# Altium project P-MT3620EXMSTLP-1-0.PrjPcb (part 1 of 3)
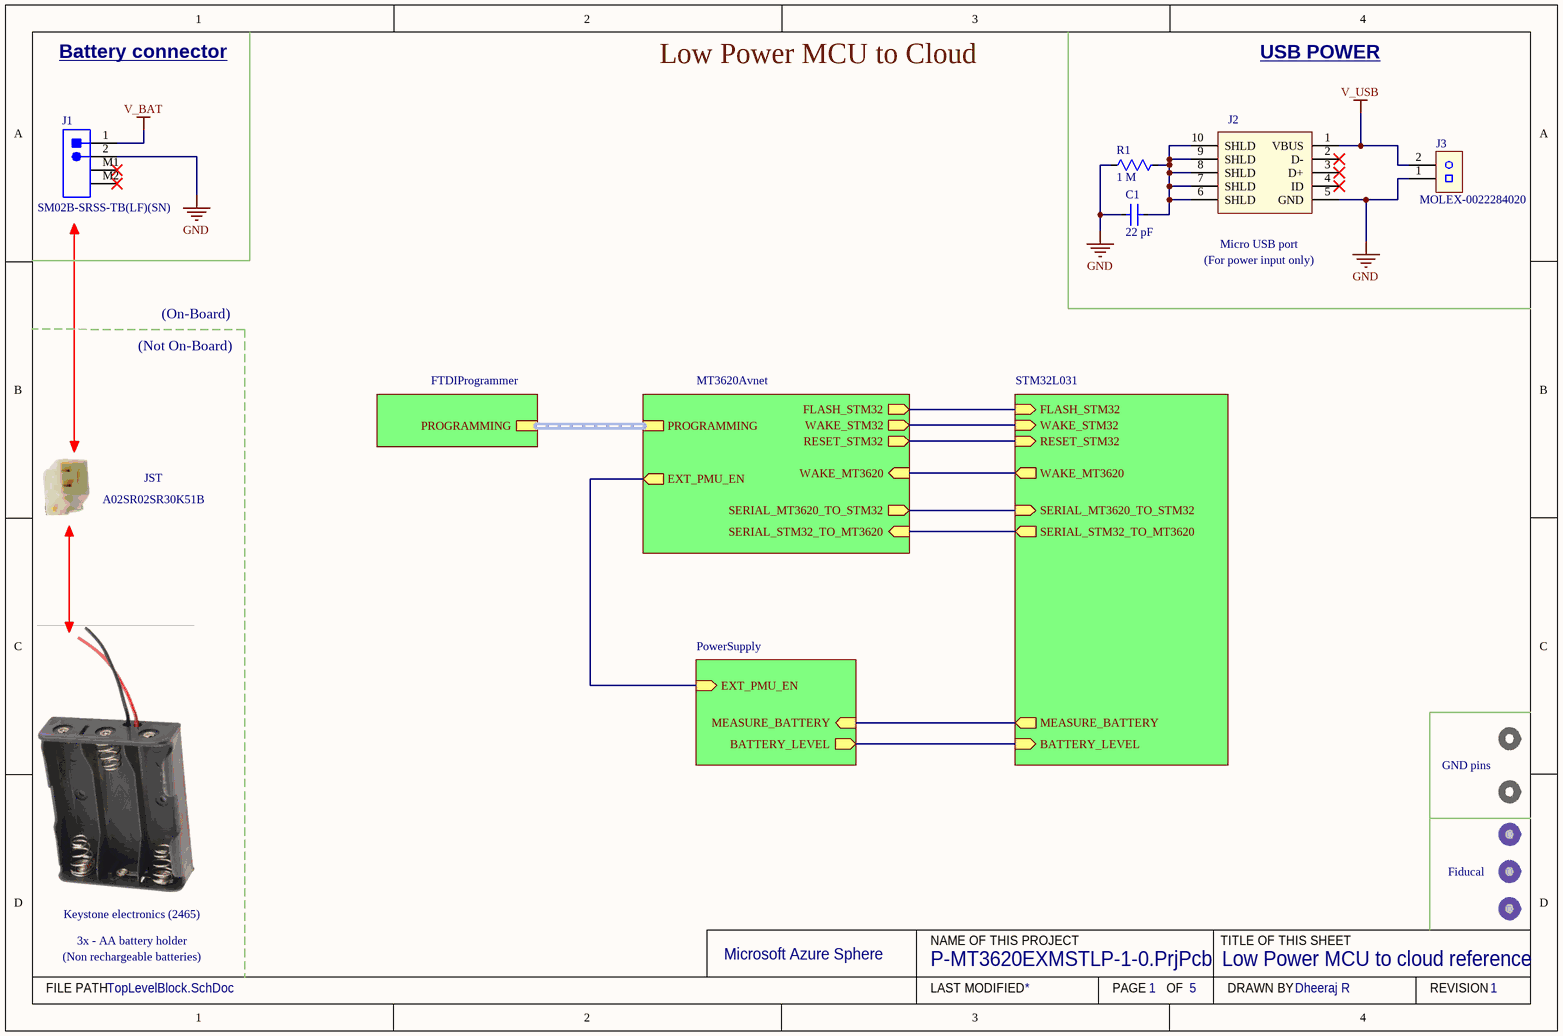
[diagram p0: TopLevelBlock.SchDoc]
DrawnBy: Dheeraj R; projectVersion: 1.0
5 sheets, 96 parts. Net scope: hierarchical (ports join the sheet entries above them; power ports are global).
Board file: P-MT3620EXMSTLP-1-0.PcbDoc
Sheets:
  TopLevelBlock.SchDoc
    FTDIProgrammer = FTDIProgrammer.SchDoc
    MT3620Avnet = MT3620AvnetModule.SchDoc
    PowerSupply = PowerSupply.SchDoc
    STM32L031 = STM32L031.SchDoc

## Sheet TopLevelBlock.SchDoc: Low Power MCU to cloud reference
size A4; DrawnBy: Dheeraj R; DocumentNumber: 1; Revision: 1; SheetNumber: 1; SheetTotal: 5

### Parts
C1  22 pF  [CC0603]
J1  SM02B-SRSS-TB(LF)(SN)  [SM02B-SRSS-TB]
J2  USB Micro-B  [MOLEX-1050170001]  (value not drawn)
J3  MOLEX-0022284020  [0022284020]
R1  1 M  [RC0603]

### Sub-sheets
FTDIProgrammer = FTDIProgrammer.SchDoc: PROGRAMMING (harness FTDIHeader)
MT3620Avnet = MT3620AvnetModule.SchDoc: SERIAL_MT3620_TO_STM32 (out), SERIAL_STM32_TO_MT3620 (in), FLASH_STM32 (out), RESET_STM32 (out), WAKE_MT3620 (in), WAKE_STM32 (out), PROGRAMMING (harness FTDIHeader), EXT_PMU_EN (out)
PowerSupply = PowerSupply.SchDoc: EXT_PMU_EN (in), MEASURE_BATTERY (in), BATTERY_LEVEL (out)
STM32L031 = STM32L031.SchDoc: SERIAL_STM32_TO_MT3620 (out), FLASH_STM32 (in), WAKE_MT3620 (out), WAKE_STM32 (in), RESET_STM32 (in), MEASURE_BATTERY (out), BATTERY_LEVEL (in), SERIAL_MT3620_TO_STM32 (in)

### Nets
GND: C1.1 J1.2 J2.5(GND) J3.1 R1.2
V_BAT: J1.1
V_USB: J2.1(VBUS) J3.2
BATTERY_LEVEL: sheet PowerSupply/BATTERY_LEVEL, sheet STM32L031/BATTERY_LEVEL
EXT_PMU_EN: sheet MT3620Avnet/EXT_PMU_EN, sheet PowerSupply/EXT_PMU_EN
FLASH_STM32: sheet MT3620Avnet/FLASH_STM32, sheet STM32L031/FLASH_STM32
MEASURE_BATTERY: sheet PowerSupply/MEASURE_BATTERY, sheet STM32L031/MEASURE_BATTERY
RESET_STM32: sheet MT3620Avnet/RESET_STM32, sheet STM32L031/RESET_STM32
STM32_RX: sheet MT3620Avnet/SERIAL_MT3620_TO_STM32, sheet STM32L031/SERIAL_MT3620_TO_STM32
STM32_TX: sheet MT3620Avnet/SERIAL_STM32_TO_MT3620, sheet STM32L031/SERIAL_STM32_TO_MT3620
WAKE_MT3620: sheet MT3620Avnet/WAKE_MT3620, sheet STM32L031/WAKE_MT3620
WAKE_STM32: sheet MT3620Avnet/WAKE_STM32, sheet STM32L031/WAKE_STM32
NetC1_2: C1.2 J2.6(SHLD) J2.7(SHLD) J2.8(SHLD) J2.9(SHLD) J2.10(SHLD) R1.1

Not connected (* = marked no-connect by the designer): J1 M1* M2*; J2 2(D-)* 3(D+)* 4(ID)*

### Buses and harness runs
harness sheet FTDIProgrammer/PROGRAMMING = sheet MT3620Avnet/PROGRAMMING

### Notes on the sheet
- Battery connector
- Low Power MCU to Cloud
- USB POWER
- (near J2) Micro USB port
- (On-Board)
- (For power input only)
- (Not On-Board)
- A02SR02SR30K51B
- JST
- GND pins
- Keystone electronics (2465)
- Fiducal
- 3x - AA battery holder
- (Non rechargeable batteries)
- Microsoft Azure Sphere
- NAME OF THIS PROJECT
- TITLE OF THIS SHEET
- FILE PATH
- LAST MODIFIED
- PAGE
- OF
- DRAWN BY
- REVISION

### Library data of the parts
C1 = CC0603JRNPO0BN220: 22PF 0603 100V C0G/NPO; Manufacturer: Yageo; Dielectric: C0G; Tolerance: 5%; Supplier 1: Digi-Key; Manufacturer Part Number: CC0603JRNPO0BN220; RoHS: Yes; Category: Ceramic Capacitors; Stock 1: 18072; Pricing 1: 1=0.10000, 10=0.06800, 50=0.03680, 100=0.03010, 500=0.02152, 1000=0.01691 (USD); Mount: Surface Mount; Case/Package: 0603; Weight: 7.1E-05oz; Case Code (Imperial): 0603; Case Code (Metric): 1608; Min Operating Temperature: -55°C; Max Operating Temperature: 125°C; Capacitance: 22pF; Termination: SMD/SMT; Composition: Ceramic; Packaging: Tape and Reel; Voltage Rating: 100V; Voltage Rating (DC): 100V; Length: 1.6mm; Height: 0.8mm; Thickness: 0.035inch; Depth: 0.8mm; Width: 0.8mm; Lead Free: Lead Free; ComponentLink1URL: https://datasheet.ciiva.com/13207/upy-gp-np0-16v-to-50v-8-13207786.pdf?src-supplier=Mouser; ComponentLink1Description: https://datasheet.ciiva.com/13207/upy-gp-np0-16v-to-50v-8-13207786.pdf?src-supplier=Mouser; Supplier Part Number 1: 311-1755-1-ND
J1 = SM02B-SRSS-TB(LF)(SN): Conn Shrouded Header HDR 2 POS 1mm Solder RA SMD T/R; Manufacturer: JST; Number of Contacts: 2; Voltage Rating: 50V; Current Rating: 700mA; Insulation Resistance: 100MR; Connector Type: Header,Male Pin; Contact Resistance: 40mR; Max Current Rating: 1A; Supplier 1: Farnell; Manufacturer Part Number: SM02B-SRSS-TB(LF)(SN); Stock 1: 47603; Pricing 1: 100=0.24600, 500=0.21400, 1000=0.17700, 2500=0.15600, 5000=0.13600, 10000=0.13000 (GBP); RoHS: Yes; Mount: Surface Mount; Contact Material: Copper Alloy,Copper; Housing Color: Beige; Material: Polyamide; Housing Material: Polyamide; Contact Shape: Square; Insulation Material: Nylon; Insulation Color: Natural; Color: Natural; Contact Plating: Tin,Copper,Lead; Min Operating Temperature: -25°C; Max Operating Temperature: 85°C; Orientation: Right Angle; Termination: Solder; Number of Rows: 1; Number of Positions: 2; Max Voltage Rating (AC): 50V; Fastening Type: Push,Pull; Packaging: Tape and Reel; Voltage Rating (AC): 50V; Length: 4mm; Pitch: 1mm; Depth: 4.95mm; Lead Pitch: 1mm; Flammability Rating: UL94 V-0; Lead Free: Lead Free; REACH SVHC: No SVHC; ComponentLink1URL: https://datasheet.ciiva.com/26924/getdatasheetpartid-640850-26924055.pdf?src-supplier=Verical; ComponentLink1Description: https://datasheet.ciiva.com/26924/getdatasheetpartid-640850-26924055.pdf?src-supplier=Verical; ComponentLink2URL: https://datasheet.ciiva.com/712/esr-712467.pdf?src-supplier=Digi-Key; ComponentLink2Description: https://datasheet.ciiva.com/712/esr-712467.pdf?src-supplier=Digi-Key; ComponentLink3URL: https://datasheet.ciiva.com/712/esr-712468.pdf?src-supplier=Digi-Key; ComponentLink3Description: https://datasheet.ciiva.com/712/esr-712468.pdf?src-supplier=Digi-Key; ComponentLink4URL: https://datasheet.ciiva.com/730/esr-730600.pdf?src-supplier=Digi-Key; ComponentLink4Description: https://datasheet.ciiva.com/730/esr-730600.pdf?src-supplier=Digi-Key; ComponentLink5URL: https://datasheet.ciiva.com/8052/91630-8052284.pdf?src-supplier=Element14; ComponentLink5Description: https://datasheet.ciiva.com/8052/91630-8052284.pdf?src-supplier=Element14; ComponentLink6URL: https://datasheet.ciiva.com/16391/sm02b-srss-tblfsn-16391308.pdf?src-supplier=Future+Electronics; ComponentLink6Description: https://datasheet.ciiva.com/16391/sm02b-srss-tblfsn-16391308.pdf?src-supplier=Future+Electronics; Supplier Part Number 1: 1679117
J2 = MOLEX-1050170001: Micro; B Type; receptacle; Bottom Mount, SMT, with Solder Tabs, Lead-Free; Manufacturer: Molex; Connector Type: USB,Receptacle; Number of Ports: 1; Number of Contacts: 5; Max Voltage Rating (AC): 30V; Current Rating: 1.8A; USB Standard: USB 2.0; Mating Cycles: 10000; Shielding: Shielded; Pitch: 0.65mm; Supplier 1: Digi-Key; Manufacturer Part Number: 1050170001; RoHS: Yes; Category: Connectors; Stock 1: 22049; Pricing 1: 1=0.91000, 10=0.80100, 25=0.75440, 50=0.72280, 100=0.69140, 250=0.62856, 500=0.56568, 1000=0.50283 (USD); Mount: Surface Mount,Through Hole; Contact Plating: Gold; Contact Material: Copper Alloy,Copper; Number of Terminals: 5; Housing Material: Polymer; Insulation Color: Black; Min Operating Temperature: -30°C; Max Operating Temperature: 85°C; Packaging: Tape and Reel; Gender: Receptacle; Package Quantity: 2000; Termination: Solder; Orientation: Right Angle; Features: Shielded; Voltage Rating (AC): 30V; Voltage Rating: 30V; Number of Positions: 5; Number of Circuits: 5; Length: 8.2mm; Depth: 7.5mm; Radiation Hardening: No; REACH SVHC: Unknown; Halogen Free: Low Halogen; Flammability Rating: UL94 V-0; ComponentLink1URL: https://datasheet.ciiva.com/3094/1050170001-io-connectors-3094416.pdf?src-supplier=Avnet; ComponentLink1Description: https://datasheet.ciiva.com/3094/1050170001-io-connectors-3094416.pdf?src-supplier=Avnet; ComponentLink2URL: https://datasheet.ciiva.com/4598/1050170001-io-connectors-152207-4598759.pdf?src-supplier=Mouser; ComponentLink2Description: https://datasheet.ciiva.com/4598/1050170001-io-connectors-152207-4598759.pdf?src-supplier=Mouser; ComponentLink3URL: https://datasheet.ciiva.com/8015/1631959-8015288.pdf?src-supplier=Element14; ComponentLink3Description: https://datasheet.ciiva.com/8015/1631959-8015288.pdf?src-supplier=Element14; ComponentLink4URL: https://datasheet.ciiva.com/851/1050170001-sd-851276.pdf?src-supplier=Digi-Key; ComponentLink4Description: https://datasheet.ciiva.com/851/1050170001-sd-851276.pdf?src-supplier=Digi-Key; ComponentLink5URL: https://datasheet.ciiva.com/5742/1598502-5742508.pdf?src-supplier=Farnell; ComponentLink5Description: https://datasheet.ciiva.com/5742/1598502-5742508.pdf?src-supplier=Farnell; ComponentLink6URL: https://datasheet.ciiva.com/22654/1688140-22654924.pdf?src-supplier=Element14; ComponentLink6Description: https://datasheet.ciiva.com/22654/1688140-22654924.pdf?src-supplier=Element14; ComponentLink7URL: https://datasheet.ciiva.com/30165/235271050170001-io-nectors-30165183.pdf?src-supplier=Onlinecomponents.com; ComponentLink7Description: https://datasheet.ciiva.com/30165/235271050170001-io-nectors-30165183.pdf?src-supplier=Onlinecomponents.com; ComponentLink8URL: https://datasheet.ciiva.com/16668/1050170001-io-connectors-16668598.pdf?src-supplier=Avnet+Europe; ComponentLink8Description: https://datasheet.ciiva.com/16668/1050170001-io-connectors-16668598.pdf?src-supplier=Avnet+Europe; ComponentLink9URL: https://datasheet.ciiva.com/851/1050170001-sd-851277.pdf?src-supplier=Digi-Key; ComponentLink9Description: https://datasheet.ciiva.com/851/1050170001-sd-851277.pdf?src-supplier=Digi-Key; ComponentLink10URL: https://datasheet.ciiva.com/851/1050170001-sd-851278.pdf?src-supplier=Digi-Key; ComponentLink10Description: https://datasheet.ciiva.com/851/1050170001-sd-851278.pdf?src-supplier=Digi-Key; Supplier Part Number 1: WM1399CT-ND
J3 = MOLEX-0022284020: CONN HEADER 2POS .100 VERT TIN; Manufacturer: Molex, LLC; Connector Type: Header, Unshrouded, Breakaway; Number of Positions: 2; Number of Positions Loaded: All; Pitch: 0.100" (2.54mm); Supplier 1: Digi-Key; Manufacturer Part Number: 0022284020; RoHS: RoHS Compliant; Category: Connectors, Interconnects; Stock 1: 10077; Pricing 1: 1=0.12, 10=0.108, 25=0.0808, 50=0.0692, 100=0.0668, 250=0.0576, 500=0.0553 (GBP); Packaging: Bulk; Contact Type: Male Pin; Number of Rows: 1; Row Spacing: -; Contact Mating Length: 0.240" (6.10mm); Mounting Type: Through Hole; Termination: Solder; Fastening Type: -; Features: -; Contact Finish: Tin; Contact Finish Thickness: 100µin (2.54µm); Color: Black; ComponentLink1URL: http://www.molex.com/pdm_docs/sd/022284020_sd.pdf; ComponentLink1Description: http://www.molex.com/pdm_docs/sd/022284020_sd.pdf; Supplier Part Number 1: WM50014-02-ND
R1 = RC0603FR-071ML: 1M 0603 Case 1% 0.1W 100ppm/C; Manufacturer: Yageo; Voltage Rating: 50V; Resistance: 1MR; Power Rating: 100mW; Temperature Coefficient: 100ppm/°C; Supplier 1: Digi-Key; Manufacturer Part Number: RC0603FR-071ML; RoHS: Yes; Category: Chip SMD Resistors; Stock 1: 2071757; Pricing 1: 1=0.10000, 10=0.02300, 100=0.00940, 1000=0.00421, 2500=0.00366 (USD); Case/Package: 0603; Number of Pins: 2; Case Code (Imperial): 0603; Case Code (Metric): 1608; Min Operating Temperature: -55°C; Max Operating Temperature: 155°C; Voltage Rating (DC): 50V; Tolerance: 1%; Packaging: Tape and Reel; Package Quantity: 5000; Termination: SMD/SMT; Composition: Thick Film; Military Standard: Not; Length: 1.6mm; Height: 0.45mm; Width: 0.8mm; Depth: 0.8mm; REACH SVHC: No SVHC; Lead Free: Lead Free; ComponentLink1URL: https://datasheet.ciiva.com/11819/0900766b80f96399-11819295.pdf?src-supplier=RSComponents; ComponentLink1Description: https://datasheet.ciiva.com/11819/0900766b80f96399-11819295.pdf?src-supplier=RSComponents; ComponentLink2URL: https://datasheet.ciiva.com/7983/443971-7983614.pdf?src-supplier=Element14; ComponentLink2Description: https://datasheet.ciiva.com/7983/443971-7983614.pdf?src-supplier=Element14; ComponentLink3URL: https://datasheet.ciiva.com/12555/rc0603-272842-12555388.pdf?src-supplier=Mouser; ComponentLink3Description: https://datasheet.ciiva.com/12555/rc0603-272842-12555388.pdf?src-supplier=Mouser; Supplier Part Number 1: 311-1.00MHRCT-ND

## Sheet FTDIProgrammer.SchDoc: FTDI Programming for MT3620
size A4; DrawnBy: Dheeraj R; DocumentNumber: 2; Revision: 1; SheetNumber: 2; SheetTotal: 5
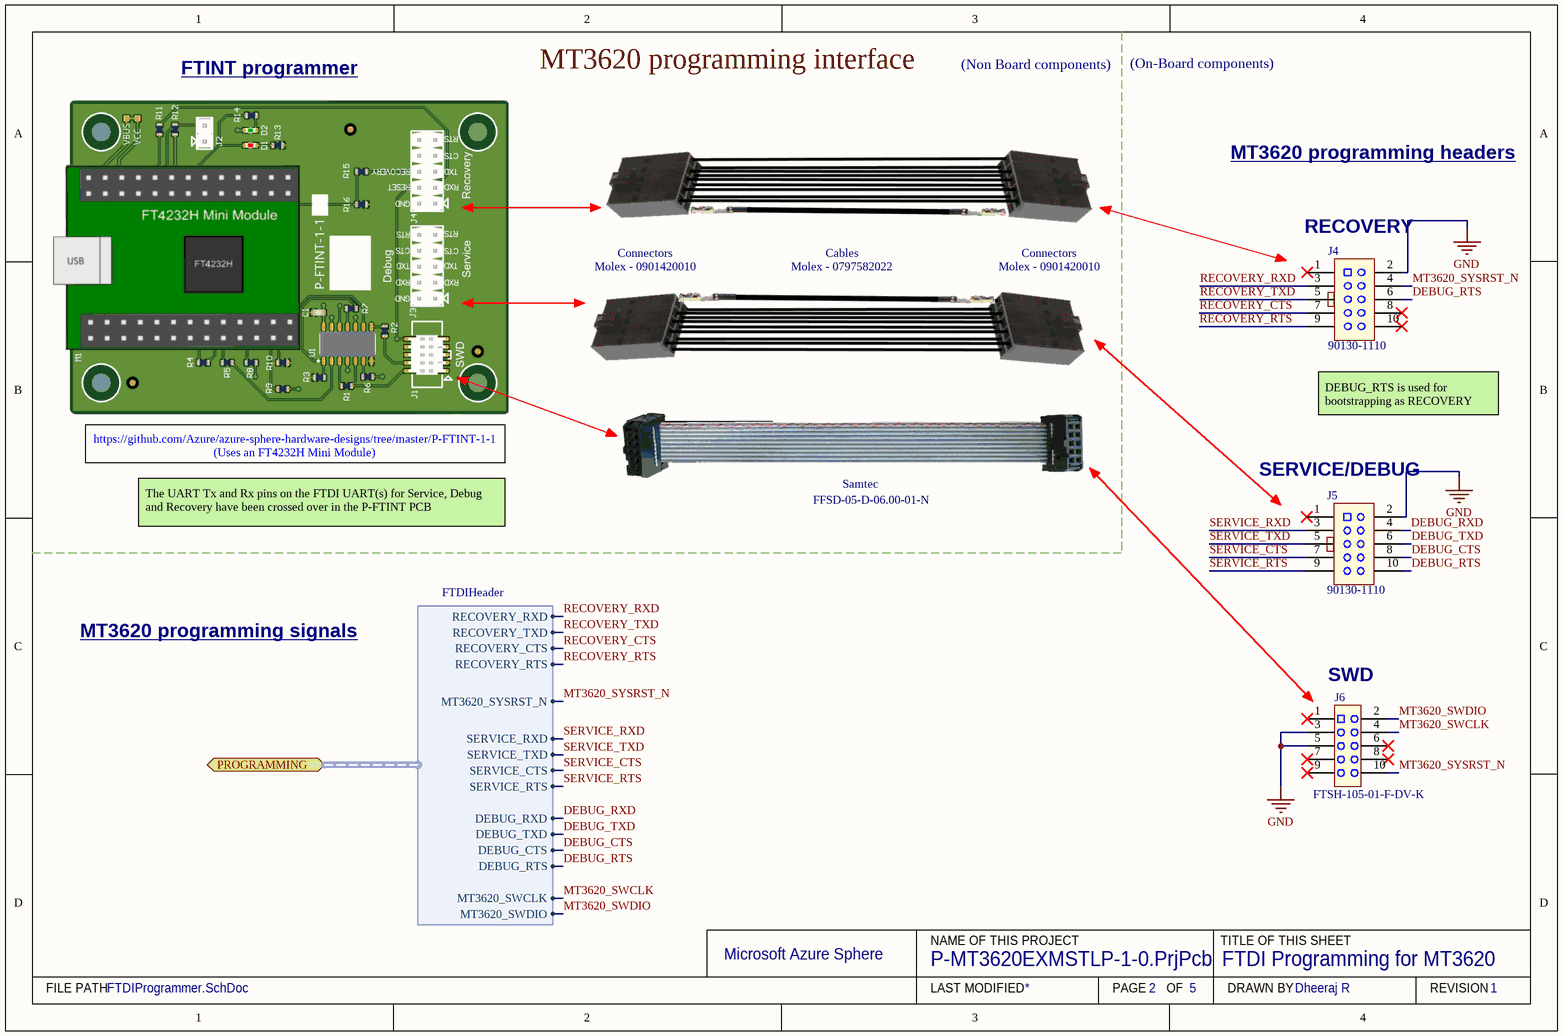
[diagram p1: FTDIProgrammer.SchDoc]

### Parts
J4  90130-1110  [0901301110]
J5  90130-1110  [0901301110]
J6  FTSH-105-01-F-DV-K  [SAMTEC-FTSH-105-01-X-DV-K]

### Ports
PROGRAMMING (bidir, harness FTDIHeader)

### Harnesses
FTDIHeader: RECOVERY_RXD, RECOVERY_TXD, RECOVERY_CTS, RECOVERY_RTS, MT3620_SYSRST_N, SERVICE_RXD, SERVICE_TXD, SERVICE_CTS, SERVICE_RTS, DEBUG_TXD, MT3620_SWCLK, MT3620_SWDIO, DEBUG_RXD, DEBUG_CTS, DEBUG_RTS

### Nets
GND: J4.2 J5.2 J6.3 J6.5
DEBUG_CTS: J5.8 ; port PROGRAMMING.DEBUG_CTS
DEBUG_RTS: J4.6 J5.10 ; port PROGRAMMING.DEBUG_RTS
DEBUG_RXD: J5.4 ; port PROGRAMMING.DEBUG_RXD
DEBUG_TXD: J5.6 ; port PROGRAMMING.DEBUG_TXD
MT3620_SWCLK: J6.4 ; port PROGRAMMING.MT3620_SWCLK
MT3620_SWDIO: J6.2 ; port PROGRAMMING.MT3620_SWDIO
MT3620_SYSRST_N: J4.4 J6.10 ; port PROGRAMMING.MT3620_SYSRST_N
RECOVERY_CTS: J4.7 ; port PROGRAMMING.RECOVERY_CTS
RECOVERY_RTS: J4.9 ; port PROGRAMMING.RECOVERY_RTS
RECOVERY_RXD: J4.3 ; port PROGRAMMING.RECOVERY_RXD
RECOVERY_TXD: J4.5 ; port PROGRAMMING.RECOVERY_TXD
SERVICE_CTS: J5.7 ; port PROGRAMMING.SERVICE_CTS
SERVICE_RTS: J5.9 ; port PROGRAMMING.SERVICE_RTS
SERVICE_RXD: J5.3 ; port PROGRAMMING.SERVICE_RXD
SERVICE_TXD: J5.5 ; port PROGRAMMING.SERVICE_TXD

Not connected (* = marked no-connect by the designer): J4 1* 8* 10*; J5 1*; J6 1* 6* 7* 8* 9*

### Notes on the sheet
- FTINT programmer
- MT3620 programming interface
- (Non Board components)
- (On-Board components)
- MT3620 programming headers
- (near J4) RECOVERY
- Connectors
  Molex - 0901420010
- Cables
  Molex - 0797582022
- (near J4) DEBUG_RTS is used for
  bootstrapping as RECOVERY
- https://github.com/Azure/azure-sphere-hardware-designs/tree/master/P-FTINT-1-1
  (Uses an FT4232H Mini Module)
- Samtec
- FFSD-05-D-06.00-01-N
- (near J5) SERVICE/DEBUG
- The UART Tx and Rx pins on the FTDI UART(s) for Service, Debug and Recovery have been crossed over in the P-FTINT PCB
- MT3620 programming signals
- (near J6) SWD
- Microsoft Azure Sphere
- NAME OF THIS PROJECT
- TITLE OF THIS SHEET
- FILE PATH
- LAST MODIFIED
- PAGE
- OF
- DRAWN BY
- REVISION

### Library data of the parts
J4 J5 = MOLEX-901301110: Conn Shrouded Header HDR 10 POS 2.54mm Solder ST Thru-Hole Tray; Manufacturer: Molex; Max Voltage Rating (DC): 350.35kV; Number of Positions: 10; Current Rating: 3A; Voltage Rating: 350V; Gender: Male; Glow Wire Compliant: Non-compliant; Supplier 1: Digi-Key; Manufacturer Part Number: 90130-1110; RoHS: Yes; Category: Headers and Wire Housings; Stock 1: 363; Pricing 1: 1=1.59000, 10=1.44600, 100=1.23900, 500=1.03250, 1000=0.88500, 5000=0.78470, 10000=0.76700 (USD); Mount: Through Hole; Contact Plating: Tin,Lead; Contact Material: Brass; Color: Black; Housing Color: Black; Housing Material: Polyester; Min Operating Temperature: -55°C; Max Operating Temperature: 125°C; Number of Rows: 2; Packaging: Tray; Termination: Through Hole; Number of Contacts: 10; Orientation: Vertical; Package Quantity: 1680; Voltage Rating (AC): 350V; Voltage Rating (DC): 350V; Number of Circuits: 10; Pitch: 2.54mm; Radiation Hardening: No; Lead Free: Lead Free; REACH SVHC: Unknown; ComponentLink1URL: https://datasheet.ciiva.com/11748/0900766b80d6024d-11748518.pdf?src-supplier=RSComponents; ComponentLink1Description: https://datasheet.ciiva.com/11748/0900766b80d6024d-11748518.pdf?src-supplier=RSComponents; ComponentLink2URL: https://datasheet.ciiva.com/5153/0901301110-pcb-headers-151692-5153946.pdf?src-supplier=Mouser; ComponentLink2Description: https://datasheet.ciiva.com/5153/0901301110-pcb-headers-151692-5153946.pdf?src-supplier=Mouser; ComponentLink3URL: https://datasheet.ciiva.com/30051/55070901301110-pcb-headers-30051500.pdf?src-supplier=Onlinecomponents.com; ComponentLink3Description: https://datasheet.ciiva.com/30051/55070901301110-pcb-headers-30051500.pdf?src-supplier=Onlinecomponents.com; Supplier Part Number 1: WM8235-ND
J6 = FTSH-105-01-F-DV-K: CONN HEADER 10POS DUAL .05" SMD; Manufacturer: Samtec Inc.; Connector Type: Header, Unshrouded; Number of Positions: 10; Number of Positions Loaded: All; Pitch: 0.050" (1.27mm); Supplier 1: Digi-Key; Manufacturer Part Number: FTSH-105-01-F-DV-K; RoHS: RoHS Compliant; Category: Connectors, Interconnects; Stock 1: 13304; Pricing 1: 1=2.26, 10=1.907, 50=1.647, 100=1.4737, 250=1.30032, 500=1.21362, 1000=1.12693, 2500=1.08358, 5000=1.06191 (GBP); Packaging: Tube; Contact Type: Male Pin; Number of Rows: 2; Row Spacing: 0.050" (1.27mm); Contact Mating Length: 0.120" (3.05mm); Mounting Type: Surface Mount; Termination: Solder; Fastening Type: -; Features: Keying Shroud; Contact Finish: Gold; Contact Finish Thickness: 3µin (0.08µm); Color: Black; ComponentLink1URL: http://suddendocs.samtec.com/prints/ftsh-1xx-xx-xxx-dv-xxx-mkt.pdf; ComponentLink1Description: http://suddendocs.samtec.com/prints/ftsh-1xx-xx-xxx-dv-xxx-mkt.pdf; Supplier Part Number 1: SAM8796-ND

## Sheet MT3620AvnetModule.SchDoc: Avnet module for MT3620
size A4; DrawnBy: Dheeraj R; DocumentNumber: 3; Revision: 1; SheetNumber: 3; SheetTotal: 5
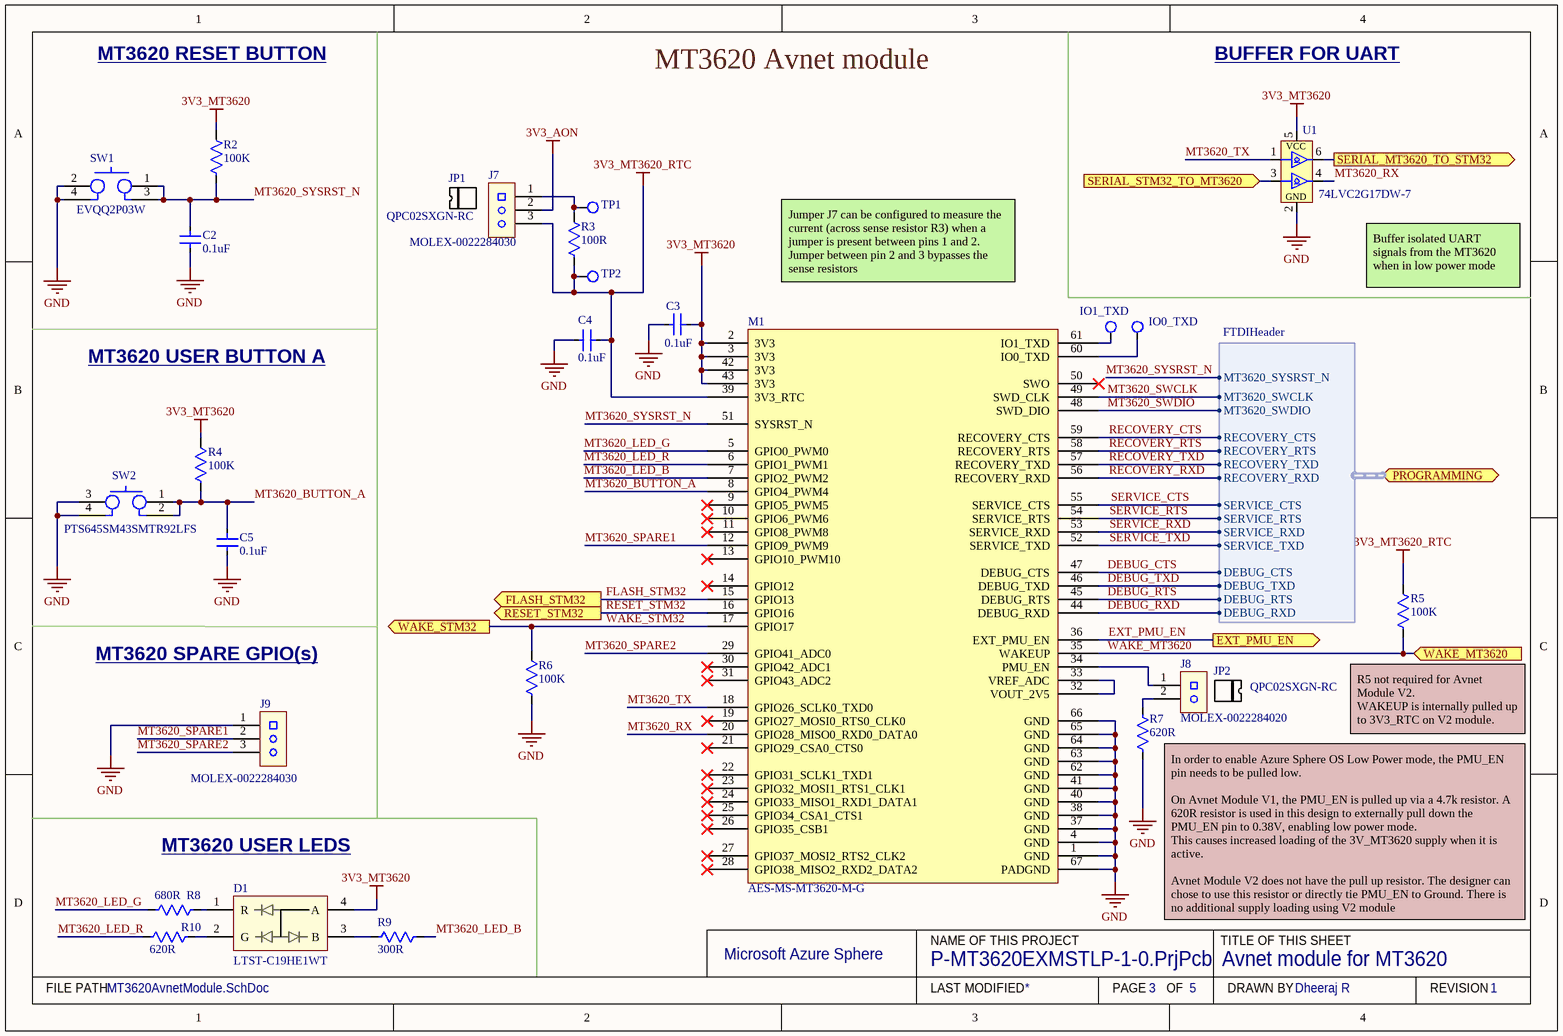
[diagram p2: MT3620AvnetModule.SchDoc]

### Parts
C2  0.1uF  [CC0603]
C3  0.1uF  [CC0603]
C4  0.1uF  [CC0603]
C5  0.1uF  [CC0603]
D1  LTST-C19HE1WT  [LTST-C19HE1WT]
IO0_TXD  TestPoint  [Pad1.27mm]  (value not drawn)  (no BOM)
IO1_TXD  TestPoint  [Pad1.27mm]  (value not drawn)  (no BOM)
J7  MOLEX-0022284030  [0022284030]
J8  MOLEX-0022284020  [0022284020]
J9  MOLEX-0022284030  [0022284030]
JP1  QPC02SXGN-RC  (mechanical)
JP2  QPC02SXGN-RC  (mechanical)
M1  AES-MS-MT3620-M-G  [AES-MS-MT3620-M-G]
R2  100K  [VISHAY-0603]
R3  100R  [VISHAY-0603]
R4  100K  [VISHAY-0603]
R5  100K  [VISHAY-0603]
R6  100K  [VISHAY-0603]
R7  620R  [RC0603]
R8  680R  [RC0603]
R9  300R  [RC0603]
R10  620R  [RC0603]
SW1  SWI TACT SPN0 PANASONIC EVQQ2P03W  [EVQQ2P03W]  (value not drawn)
SW2  PTS645SM43SMTR92LFS  [C&K PTS645SM43SMTR92LFS]
TP1  TestPointHole  [PTH1.27mm-0.9mm]  (value not drawn)  (no BOM)
TP2  TestPointHole  [PTH1.27mm-0.9mm]  (value not drawn)  (no BOM)
U1  74LVC2G17DW-7  [Nexperia-SOT363]

### Ports
EXT_PMU_EN (out), FLASH_STM32 (out), PROGRAMMING (bidir, harness FTDIHeader), RESET_STM32 (out), SERIAL_MT3620_TO_STM32 (out), SERIAL_STM32_TO_MT3620 (in), WAKE_MT3620 (in), WAKE_STM32 (out)

### Harnesses
FTDIHeader: RECOVERY_RXD, RECOVERY_TXD, RECOVERY_CTS, RECOVERY_RTS, MT3620_SYSRST_N, SERVICE_RXD, SERVICE_TXD, SERVICE_CTS, SERVICE_RTS, DEBUG_TXD, MT3620_SWCLK, MT3620_SWDIO, DEBUG_CTS, DEBUG_RTS, DEBUG_RXD

### Nets
3V3_AON: J7.2
3V3_MT3620: C3.2 D1.4(A) M1.2(3V3) M1.3(3V3) M1.42(3V3) M1.43(3V3) R2.2 R4.2 U1.5
3V3_MT3620_RTC: C4.2 J7.3 M1.39(3V3_RTC) R3.2 R5.2 TP2.1
GND: C2.1 C3.1 C4.1 C5.1 J9.1 M1.1(GND) M1.4(GND) M1.37(GND) M1.38(GND) M1.40(GND) M1.41(GND) M1.62(GND) M1.63(GND) M1.64(GND) M1.65(GND) M1.66(GND) M1.67(PADGND) R6.1 R7.1 SW1.2 SW1.4 SW2.3 SW2.4 U1.2
DEBUG_CTS: M1.47(DEBUG_CTS) ; port PROGRAMMING.DEBUG_CTS
DEBUG_RTS: M1.45(DEBUG_RTS) ; port PROGRAMMING.DEBUG_RTS
DEBUG_RXD: M1.44(DEBUG_RXD) ; port PROGRAMMING.DEBUG_RXD
DEBUG_TXD: M1.46(DEBUG_TXD) ; port PROGRAMMING.DEBUG_TXD
EXT_PMU_EN: M1.36(EXT_PMU_EN) ; port EXT_PMU_EN
FLASH_STM32: M1.15(GPIO13) ; port FLASH_STM32
MT3620_BUTTON_A: C5.2 M1.8(GPIO4_PWM4) R4.1 SW2.1 SW2.2
MT3620_LED_B: M1.7(GPIO2_PWM2) R9.2
MT3620_LED_G: M1.5(GPIO0_PWM0) R8.1
MT3620_LED_R: M1.6(GPIO1_PWM1) R10.1
MT3620_RX: M1.20(GPIO28_MISO0_RXD0_DATA0) U1.4
MT3620_SPARE1: J9.2 M1.12(GPIO9_PWM9)
MT3620_SPARE2: J9.3 M1.29(GPIO41_ADC0)
MT3620_SWCLK: M1.49(SWD_CLK) ; port PROGRAMMING.MT3620_SWCLK
MT3620_SWDIO: M1.48(SWD_DIO) ; port PROGRAMMING.MT3620_SWDIO
MT3620_SYSRST_N: C2.2 M1.51(SYSRST_N) R2.1 SW1.1 SW1.3 ; port PROGRAMMING.MT3620_SYSRST_N
MT3620_TX: M1.18(GPIO26_SCLK0_TXD0) U1.1
RECOVERY_CTS: M1.59(RECOVERY_CTS) ; port PROGRAMMING.RECOVERY_CTS
RECOVERY_RTS: M1.58(RECOVERY_RTS) ; port PROGRAMMING.RECOVERY_RTS
RECOVERY_RXD: M1.56(RECOVERY_RXD) ; port PROGRAMMING.RECOVERY_RXD
RECOVERY_TXD: M1.57(RECOVERY_TXD) ; port PROGRAMMING.RECOVERY_TXD
RESET_STM32: M1.16(GPIO16) ; port RESET_STM32
SERVICE_CTS: M1.55(SERVICE_CTS) ; port PROGRAMMING.SERVICE_CTS
SERVICE_RTS: M1.54(SERVICE_RTS) ; port PROGRAMMING.SERVICE_RTS
SERVICE_RXD: M1.53(SERVICE_RXD) ; port PROGRAMMING.SERVICE_RXD
SERVICE_TXD: M1.52(SERVICE_TXD) ; port PROGRAMMING.SERVICE_TXD
STM32_RX: U1.6 ; port SERIAL_MT3620_TO_STM32
STM32_TX: U1.3 ; port SERIAL_STM32_TO_MT3620
WAKE_MT3620: M1.35(WAKEUP) R5.1 ; port WAKE_MT3620
WAKE_STM32: M1.17(GPIO17) R6.2 ; port WAKE_STM32
NetD1_1: D1.1(R) R8.2
NetD1_2: D1.2(G) R10.2
NetD1_3: D1.3(B) R9.1
NetIO0_TXD_1: IO0_TXD.1 M1.60(IO0_TXD)
NetIO1_TXD_1: IO1_TXD.1 M1.61(IO1_TXD)
NetJ7_1: J7.1 R3.1 TP1.1
NetJ8_1: J8.1 M1.34(PMU_EN)
NetJ8_2: J8.2 R7.2
NetM1_32: M1.32(VOUT_2V5) M1.33(VREF_ADC)

Not connected (* = marked no-connect by the designer): M1 9(GPIO5_PWM5)* 10(GPIO6_PWM6)* 11(GPIO8_PWM8)* 13(GPIO10_PWM10)* 14(GPIO12)* 19(GPIO27_MOSI0_RTS0_CLK0)* 21(GPIO29_CSA0_CTS0)* 22(GPIO31_SCLK1_TXD1)* 23(GPIO32_MOSI1_RTS1_CLK1)* 24(GPIO33_MISO1_RXD1_DATA1)* 25(GPIO34_CSA1_CTS1)* 26(GPIO35_CSB1)* 27(GPIO37_MOSI2_RTS2_CLK2)* 28(GPIO38_MISO2_RXD2_DATA2)* 30(GPIO42_ADC1)* 31(GPIO43_ADC2)* 50(SWO)*

### Notes on the sheet
- MT3620 RESET BUTTON
- MT3620 Avnet module
- BUFFER FOR UART
- Jumper J7 can be configured to measure the current (across sense resistor R3) when a jumper is present between pins 1 and 2.
  Jumper between pin 2 and 3 bypasses the sense resistors
- Buffer isolated UART signals from the MT3620 when in low power mode
- MT3620 USER BUTTON A
- MT3620 SPARE GPIO(s)
- (near R5) R5 not required for Avnet Module V2.
  WAKEUP is internally pulled up to 3V3_RTC on V2 module.
- MT3620 USER LEDS
- (near R7) In order to enable Azure Sphere OS Low Power mode, the PMU_EN pin needs to be pulled low.
  On Avnet Module V1, the PMU_EN is pulled up via a 4.7k resistor. A 620R resistor is used in this design to externally pull down the PMU_EN pin to 0.38V, enabling low power mode.
  This causes increased loading of the 3V_MT3620 supply when it is active.
  Avnet Module V2 does not have the pull up resistor. The designer can chose to use this resistor or directly tie PMU_EN to Ground. There is no additional supply loading using V2 module
- Microsoft Azure Sphere
- NAME OF THIS PROJECT
- TITLE OF THIS SHEET
- FILE PATH
- LAST MODIFIED
- PAGE
- OF
- DRAWN BY
- REVISION
- (in symbol 74LVC2G17DW-7) VCC; GND

### Library data of the parts
C2-C5 = CC0603KRX7R8BB104: 0.1uF, 0603, CC0603KRX7R8BB104, Yageo, 25V, X7R, 10%, FULL REEL; Capacitance: 100nF; Supplier 1: Digi-Key; Manufacturer: Yageo; Manufacturer Part Number: CC0603KRX7R8BB104; RoHS: Yes; Category: Ceramic Capacitors; Stock 1: 12615855; Pricing 1: 1=0.10000, 10=0.05300, 100=0.02340, 500=0.01674, 1000=0.01316 (USD); Mount: Surface Mount; Case/Package: 0603; Number of Pins: 2; Case Code (Imperial): 0603; Case Code (Metric): 1608; Min Operating Temperature: -55°C; Max Operating Temperature: 125°C; Tolerance: 10%; Dielectric: X7R; Voltage Rating: 25V; Packaging: Tape and Reel; Package Quantity: 1; Voltage Rating (DC): 25V; Termination: SMD/SMT; Composition: Ceramic; Voltage: 25V; Length: 1.6mm; Height: 0.8mm; Width: 0.8mm; Thickness: 0.035inch; Depth: 0.8mm; Radiation Hardening: No; REACH SVHC: Unknown; Lead Free: Lead Free; Halogen Free: Halogen Free; ComponentLink1URL: https://datasheet.ciiva.com/11786/0900766b80c10176-11786120.pdf?src-supplier=RSComponents; ComponentLink1Description: https://datasheet.ciiva.com/11786/0900766b80c10176-11786120.pdf?src-supplier=RSComponents; ComponentLink2URL: https://datasheet.ciiva.com/144/mlccorderingcode-144075.pdf?src-supplier=Digi-Key; ComponentLink2Description: https://datasheet.ciiva.com/144/mlccorderingcode-144075.pdf?src-supplier=Digi-Key; ComponentLink3URL: https://datasheet.ciiva.com/17434/upy-gphc-x7r-6-3v-to-50v-8-17434263.pdf?src-supplier=Avnet+Europe; ComponentLink3Description: https://datasheet.ciiva.com/17434/upy-gphc-x7r-6-3v-to-50v-8-17434263.pdf?src-supplier=Avnet+Europe; ComponentLink4URL: https://datasheet.ciiva.com/26829/getdatasheetpartid-403577-26829431.pdf?src-supplier=Verical; ComponentLink4Description: https://datasheet.ciiva.com/26829/getdatasheetpartid-403577-26829431.pdf?src-supplier=Verical; ComponentLink5URL: https://datasheet.ciiva.com/11587/upy-gphc-x7r-6-3v-to-50v-8-11587208.pdf?src-supplier=Avnet; ComponentLink5Description: https://datasheet.ciiva.com/11587/upy-gphc-x7r-6-3v-to-50v-8-11587208.pdf?src-supplier=Avnet; ComponentLink6URL: https://datasheet.ciiva.com/13389/upy-gphc-x7r-6-3v-to-50v-8-13389352.pdf?src-supplier=Mouser; ComponentLink6Description: https://datasheet.ciiva.com/13389/upy-gphc-x7r-6-3v-to-50v-8-13389352.pdf?src-supplier=Mouser; ComponentLink7URL: https://datasheet.ciiva.com/28450/1489800-28450584.pdf?src-supplier=Element14; ComponentLink7Description: https://datasheet.ciiva.com/28450/1489800-28450584.pdf?src-supplier=Element14; ComponentLink8URL: https://datasheet.ciiva.com/144/mlccorderingcode-144073.pdf?src-supplier=Digi-Key; ComponentLink8Description: https://datasheet.ciiva.com/144/mlccorderingcode-144073.pdf?src-supplier=Digi-Key; ComponentLink9URL: https://datasheet.ciiva.com/144/mlccorderingcode-144074.pdf?src-supplier=Digi-Key; ComponentLink9Description: https://datasheet.ciiva.com/144/mlccorderingcode-144074.pdf?src-supplier=Digi-Key; ComponentLink10URL: https://datasheet.ciiva.com/7978/1489800-7978155.pdf?src-supplier=Element14; ComponentLink10Description: https://datasheet.ciiva.com/7978/1489800-7978155.pdf?src-supplier=Element14; Supplier Part Number 1: 311-1341-1-ND
D1 = LTST-C19HE1WT: LED RGB DIFFUSED 0606 SMD; Manufacturer: Lite-On Inc.; Color: Red, Green, Blue (RGB); Lens Color: White; Millicandela Rating: 112.5mcd Red, 281mcd Green, 104mcd Blue; Lens Style/Size: Rectangle with Flat Top, 1.15mm x 1.60mm; Voltage - Forward (Vf) (Typ): 2.1V Red, 3.35V Green, 3.35V Blue; Current - Test: 20mA Red, 20mA Green, 20mA Blue; Viewing Angle: 130°; Wavelength - Dominant: 624nm Red, 525nm Green, 470nm Blue; Wavelength - Peak: 632nm Red, 520nm Green, 468nm Blue; Supplier 1: Digi-Key; Manufacturer Part Number: LTST-C19HE1WT; RoHS: RoHS Compliant; Category: Optoelectronics; Stock 1: 464778; Pricing 1: 1=0.45, 10=0.32, 25=0.2616, 100=0.2093, 250=0.17664, 500=0.15048, 1000=0.11776 (GBP); Packaging: Cut Tape (CT); Part Status: Active; Lens Transparency: Diffused; Mounting Type: Surface Mount; Features: -; Package / Case: 0606 (1616 Metric); Supplier Device Package: *; Size / Dimension: 1.60mm L x 1.60mm W; Height (Max): 0.35mm; ComponentLink1URL: http://optoelectronics.liteon.com/upload/download/DS22-2008-0044/S_110_LTST-C19HE1WT.pdf; ComponentLink1Description: http://optoelectronics.liteon.com/upload/download/DS22-2008-0044/S_110_LTST-C19HE1WT.pdf; Supplier Part Number 1: 160-2162-1-ND
IO0_TXD IO1_TXD = TestPoint: Test Point
J7 J9 = MOLEX-0022284030: CONN HEADER 3POS .100 VERT TIN; Manufacturer: Molex, LLC; Connector Type: Header, Unshrouded, Breakaway; Number of Positions: 3; Number of Positions Loaded: All; Pitch: 0.100" (2.54mm); Supplier 1: Digi-Key; Manufacturer Part Number: 0022284030; RoHS: RoHS Compliant; Category: Connectors, Interconnects; Stock 1: 4665; Pricing 1: 1=0.12, 10=0.115, 25=0.0984, 50=0.086, 100=0.0799, 250=0.07068, 500=0.0676 (GBP); Packaging: Bulk; Contact Type: Male Pin; Number of Rows: 1; Row Spacing: -; Contact Mating Length: 0.240" (6.10mm); Mounting Type: Through Hole; Termination: Solder; Fastening Type: -; Features: -; Contact Finish: Tin; Contact Finish Thickness: 100µin (2.54µm); Color: Black; ComponentLink1URL: http://www.molex.com/pdm_docs/sd/022284030_sd.pdf; ComponentLink1Description: http://www.molex.com/pdm_docs/sd/022284030_sd.pdf; Supplier Part Number 1: WM50014-03-ND
J8 = MOLEX-0022284020: as J3 on sheet TopLevelBlock; Supplier 1: Digi-Key; Manufacturer Part Number: 0022284020; RoHS: RoHS Compliant; Category: Connectors, Interconnects; Stock 1: 10077; Pricing 1: 1=0.12, 10=0.108, 25=0.0808, 50=0.0692, 100=0.0668, 250=0.0576, 500=0.0553 (GBP); Packaging: Bulk; Contact Type: Male Pin; Number of Rows: 1; Row Spacing: -; Contact Mating Length: 0.240" (6.10mm); Mounting Type: Through Hole; Termination: Solder; Fastening Type: -; Features: -; Contact Finish: Tin; Contact Finish Thickness: 100µin (2.54µm); Color: Black; ComponentLink1URL: http://www.molex.com/pdm_docs/sd/022284020_sd.pdf; ComponentLink1Description: http://www.molex.com/pdm_docs/sd/022284020_sd.pdf; Supplier Part Number 1: WM50014-02-ND
JP1 JP2 = QPC02SXGN-RC: CONN JUMPER SHORTING .100" GOLD; Manufacturer: Sullins; Number of Positions: 2; Pitch: 0.1inch; Supplier 1: Digi-Key; Manufacturer Part Number: QPC02SXGN-RC; RoHS: Yes; Category: Connectors; Stock 1: 717508; Pricing 1: 1=0.10000, 10=0.05900, 25=0.04400, 50=0.03780, 100=0.03650, 250=0.03152, 500=0.03024, 1000=0.02646, 2500=0.02394 (USD); Case/Package: 100; Contact Plating: Gold; Package Quantity: 2000; Packaging: Bulk; Height: 0.235inch; Lead Free: Lead Free; ComponentLink1URL: https://datasheet.ciiva.com/767/284-sxgn-11510-767869.pdf?src-supplier=Digi-Key; ComponentLink1Description: https://datasheet.ciiva.com/767/284-sxgn-11510-767869.pdf?src-supplier=Digi-Key; Supplier Part Number 1: S9337-ND
M1 = AES-MS-MT3620-M-G (SAT)
R2 R4-R6 = RC0603FR-07100KL: 100K Ohm 0603 1% 0.1W(1/10W) 100ppm Paper T/R; Manufacturer: Yageo; Resistance: 100kR; Temperature Coefficient: 100ppm/°C; Voltage Rating (DC): 50V; Power Rating: 100mW; Working Voltage: 75V; Supplier 1: Digi-Key; Manufacturer Part Number: RC0603FR-07100KL; RoHS: Yes; Category: Chip SMD Resistors; Stock 1: 18400350; Pricing 1: 1=0.10000, 10=0.02300, 100=0.00940, 1000=0.00421, 2500=0.00366 (USD); Case/Package: 0603; Number of Pins: 2; Case Code (Imperial): 0603; Case Code (Metric): 1608; Min Operating Temperature: -55°C; Max Operating Temperature: 155°C; Tolerance: 1%; Composition: Thick Film; Packaging: Tape and Reel; Voltage Rating: 50V; Termination: SMD/SMT; Military Standard: Not; Number of Terminations: 2; Length: 1.6mm; Height: 0.45mm; Width: 0.8mm; Depth: 0.8mm; REACH SVHC: No SVHC; Lead Free: Lead Free; ComponentLink1URL: https://datasheet.ciiva.com/11808/0900766b80f96399-11808107.pdf?src-supplier=RSComponents; ComponentLink1Description: https://datasheet.ciiva.com/11808/0900766b80f96399-11808107.pdf?src-supplier=RSComponents; ComponentLink2URL: https://datasheet.ciiva.com/7983/443971-7983593.pdf?src-supplier=Element14; ComponentLink2Description: https://datasheet.ciiva.com/7983/443971-7983593.pdf?src-supplier=Element14; ComponentLink3URL: https://datasheet.ciiva.com/46440/1868787-46440889.pdf?src-supplier=Element14; ComponentLink3Description: https://datasheet.ciiva.com/46440/1868787-46440889.pdf?src-supplier=Element14; ComponentLink4URL: https://datasheet.ciiva.com/7746/1738695-7746234.pdf?src-supplier=Element14; ComponentLink4Description: https://datasheet.ciiva.com/7746/1738695-7746234.pdf?src-supplier=Element14; ComponentLink5URL: https://datasheet.ciiva.com/7746/1738695-7746235.pdf?src-supplier=Element14; ComponentLink5Description: https://datasheet.ciiva.com/7746/1738695-7746235.pdf?src-supplier=Element14; ComponentLink6URL: https://datasheet.ciiva.com/22747/443971-22747516.pdf?src-supplier=Element14; ComponentLink6Description: https://datasheet.ciiva.com/22747/443971-22747516.pdf?src-supplier=Element14; Supplier Part Number 1: 311-100KHRCT-ND
R3 = PCAN0603E1000BST5: 100 OHM Current Sense 0.1% 1/2W 0603; Manufacturer: Vishay Dale Thin Film; Max Power Dissipation: 500mW; Temperature Coefficient: 25ppm/°C; Supplier 1: Digi-Key; Manufacturer Part Number: PCAN0603E1000BST5; RoHS: Yes; Category: Chip SMD Resistors; Stock 1: 20633; Pricing 1: 1=1.31000, 10=1.15900, 100=0.84150 (USD); Case/Package: 0603; Case Code (Imperial): 0603; Case Code (Metric): 1608; Min Operating Temperature: -55°C; Max Operating Temperature: 155°C; Features: Moisture Resistant; Packaging: Tape and Reel; Resistance: 100R; Composition: Thin Film; Tolerance: 0.1%; Number of Terminations: 2; Length: 0.064inch; Height: 0.018inch; Width: 0.032inch; ComponentLink1URL: http://www.vishay.com/docs/60125/pcan.pdf?src-supplier=Digi-Key; ComponentLink1Description: http://www.vishay.com/docs/60125/pcan.pdf?src-supplier=Digi-Key; ComponentLink2URL: http://www.vishay.com/docs/49563/_pcan_vmn-pt0416.pdf?src-supplier=Digi-Key; ComponentLink2Description: http://www.vishay.com/docs/49563/_pcan_vmn-pt0416.pdf?src-supplier=Digi-Key; Supplier Part Number 1: 764-1252-1-ND
R7 R10 = RC0603FR-07620RL: 620 Ohm, 0603, 1% 0.1W(1/10W) 100ppm/ C Molded SMD Paper T/R; Manufacturer: Yageo; Power Rating: 100mW; Voltage Rating: 75V; Temperature Coefficient: 100ppm/°C; Voltage Rating (DC): 50V; Supplier 1: Digi-Key; Manufacturer Part Number: RC0603FR-07620RL; RoHS: Yes; Category: Chip SMD Resistors; Stock 1: 488; Pricing 1: 1=0.10000, 10=0.02300, 100=0.00940, 1000=0.00421, 2500=0.00366 (USD); Case/Package: 0603; Weight: 7.1E-05oz; Case Code (Imperial): 0603; Case Code (Metric): 1608; Min Operating Temperature: -55°C; Max Operating Temperature: 155°C; Resistance: 620R; Tolerance: 1%; Packaging: Tape and Reel; Termination: SMD/SMT; Composition: Thick Film; Military Standard: Not; Length: 1.6mm; Height: 0.45mm; Width: 0.8mm; Depth: 0.8mm; Lead Free: Lead Free; ComponentLink1URL: http://components.arrow.com/part/dataview/0323_00047453?src-supplier=Arrow+Europe; ComponentLink1Description: http://components.arrow.com/part/dataview/0323_00047453?src-supplier=Arrow+Europe; ComponentLink2URL: http://www.mouser.com/ds/2/447/RC0603-272842.pdf?src-supplier=Mouser; ComponentLink2Description: http://www.mouser.com/ds/2/447/RC0603-272842.pdf?src-supplier=Mouser; ComponentLink3URL: http://www.yageo.com/documents/recent/PYu-RC_Group_51_RoHS_L_10.pdf?src-supplier=Digi-Key; ComponentLink3Description: http://www.yageo.com/documents/recent/PYu-RC_Group_51_RoHS_L_10.pdf?src-supplier=Digi-Key; ComponentLink4URL: http://www.yageo.com/documents/recent/PYu-RC0603_51_RoHS_L_7.pdf?src-supplier=Future+Electronics; ComponentLink4Description: http://www.yageo.com/documents/recent/PYu-RC0603_51_RoHS_L_7.pdf?src-supplier=Future+Electronics; ComponentLink5URL: http://www.yageo.com/documents/recent/PYu-RC_Group_51_RoHS_L_9.pdf?src-supplier=Digi-Key; ComponentLink5Description: http://www.yageo.com/documents/recent/PYu-RC_Group_51_RoHS_L_9.pdf?src-supplier=Digi-Key; Supplier Part Number 1: 311-620HRCT-ND
R8 = RC0603FR-07680RL: 680R, 0603 YAGEO - RC0603FR-07680RL - SMD Chip Resistor, RC Series, 50 V, Thick Film, 100 mW; Tolerance: 1%; Temperature Coefficient: 100ppm/°C; Voltage Rating (DC): 50V; Power Rating: 100mW; Supplier 1: Digi-Key; Manufacturer: Yageo; Manufacturer Part Number: RC0603FR-07680RL; RoHS: Yes; Category: Chip SMD Resistors; Stock 1: 2382438; Pricing 1: 1=0.10000, 10=0.02300, 100=0.00940, 1000=0.00421, 2500=0.00366 (USD); Case/Package: 0603; Number of Pins: 2; Case Code (Imperial): 0603; Case Code (Metric): 1608; Min Operating Temperature: -55°C; Max Operating Temperature: 155°C; Resistance: 680R; Composition: Thick Film; Packaging: Tape and Reel; Number of Terminations: 2; Military Standard: Not; Voltage Rating: 50V; Package Quantity: 1; Max Power Dissipation: 100mW; Features: Moisture Resistant; Termination: SMD/SMT; Length: 1.6mm; Height: 0.022inch; Width: 0.031inch; Depth: 0.8mm; REACH SVHC: No SVHC; Lead Free: Lead Free; ComponentLink1URL: https://datasheet.ciiva.com/2553/pyu-r-int-thick-7-2553546.pdf?src-supplier=Digi-Key; ComponentLink1Description: https://datasheet.ciiva.com/2553/pyu-r-int-thick-7-2553546.pdf?src-supplier=Digi-Key; ComponentLink2URL: https://datasheet.ciiva.com/7746/443971-7746389.pdf?src-supplier=Element14; ComponentLink2Description: https://datasheet.ciiva.com/7746/443971-7746389.pdf?src-supplier=Element14; ComponentLink3URL: https://datasheet.ciiva.com/46412/443971-46412854.pdf?src-supplier=Element14; ComponentLink3Description: https://datasheet.ciiva.com/46412/443971-46412854.pdf?src-supplier=Element14; ComponentLink4URL: https://datasheet.ciiva.com/2553/pyu-r-int-thick-7-2553545.pdf?src-supplier=Digi-Key; ComponentLink4Description: https://datasheet.ciiva.com/2553/pyu-r-int-thick-7-2553545.pdf?src-supplier=Digi-Key; ComponentLink5URL: https://datasheet.ciiva.com/2553/pyu-r-int-thick-7-2553547.pdf?src-supplier=Digi-Key; ComponentLink5Description: https://datasheet.ciiva.com/2553/pyu-r-int-thick-7-2553547.pdf?src-supplier=Digi-Key; Supplier Part Number 1: 311-680HRCT-ND
R9 = RC0603FR-07300RL: 300 Ohm, 0603, 1% 0.1W(1/10W) 100ppm/ C Molded SMD Paper T/R; Manufacturer: Yageo; Power Rating: 100mW; Voltage Rating: 50V; Temperature Coefficient: 100ppm/°C; Working Voltage: 75V; Supplier 1: Digi-Key; Manufacturer Part Number: RC0603FR-07300RL; RoHS: Yes; Category: Chip SMD Resistors; Stock 1: 798546; Pricing 1: 1=0.10000, 10=0.02300, 100=0.00940, 1000=0.00421, 2500=0.00366 (USD); Case/Package: 0603; Number of Pins: 2; Case Code (Imperial): 0603; Case Code (Metric): 1608; Min Operating Temperature: -55°C; Max Operating Temperature: 155°C; Resistance: 300R; Tolerance: 1%; Package Quantity: 1; Packaging: Tape and Reel; Termination: SMD/SMT; Composition: Thick Film; Number of Terminations: 2; Military Standard: Not; Max Power Dissipation: 100mW; Voltage Rating (DC): 50V; Features: Moisture Resistant; Length: 1.6mm; Height: 0.022inch; Width: 0.8mm; Depth: 0.8mm; REACH SVHC: Unknown; Lead Free: Lead Free; ComponentLink1URL: https://datasheet.ciiva.com/2454/pyu-r-int-thick-7-2454627.pdf?src-supplier=Digi-Key; ComponentLink1Description: https://datasheet.ciiva.com/2454/pyu-r-int-thick-7-2454627.pdf?src-supplier=Digi-Key; ComponentLink2URL: https://datasheet.ciiva.com/2454/pyu-r-int-thick-7-2454628.pdf?src-supplier=Digi-Key; ComponentLink2Description: https://datasheet.ciiva.com/2454/pyu-r-int-thick-7-2454628.pdf?src-supplier=Digi-Key; ComponentLink3URL: https://datasheet.ciiva.com/2454/pyu-r-int-thick-7-2454629.pdf?src-supplier=Digi-Key; ComponentLink3Description: https://datasheet.ciiva.com/2454/pyu-r-int-thick-7-2454629.pdf?src-supplier=Digi-Key; ComponentLink4URL: https://datasheet.ciiva.com/46395/443971-46395002.pdf?src-supplier=Element14; ComponentLink4Description: https://datasheet.ciiva.com/46395/443971-46395002.pdf?src-supplier=Element14; Supplier Part Number 1: 311-300HRCT-ND
SW1 = SWI TACT SPN0 PANASONIC EVQQ2P03W: PANASONIC - EVQQ2P03W - SWITCH, SPNO, SMD; Switch Function Type: SPST Push; Max Contact Voltage AC: 250; Max Contact Voltage DC: 15; Max Contact Current DC: 20; Supplier 1: Farnell; Manufacturer: PANASONIC; RoHS: YES; Category: Switches & Relays; Stock 1: 3989; Pricing 1: 1=0.38, 50=0.29, 100=0.23 (GBP); Series: EVQQ2; Contact Configuration: SPNO; Terminal Type: SMD; ComponentLink1URL: http://www.farnell.com/datasheets/28111.pdf; ComponentLink1Description: http://www.farnell.com/datasheets/28111.pdf; Supplier Part Number 1: 9962859RL; Manufacturer Part Number: EVQQ2P03W
SW2 = PTS645SM43SMTR92LFS: SWITCH TACTILE SPST-NO 0.05A 12V; Manufacturer: ITT C&K; Mechanical Life: 100000Cycles; Actuator Material: Nylon,Polyamide; Throw Configuration: SPST; Operating Force: 160gf; Contact Resistance: 100mR; Max Current Rating: 50mA; Illumination Type: Non-Illuminated,Illuminated; Switch Function: Off-Mom; Actuator Type: Standard; Actuator Length: 0.85mm; Supplier 1: Digi-Key; Manufacturer Part Number: PTS645SM43SMTR92LFS; RoHS: Yes; Category: Tactile Switches; Stock 1: 233515; Pricing 1: 1=0.28000, 10=0.26600, 25=0.25240, 100=0.22860, 250=0.20840, 500=0.19372 (USD); Mount: Surface Mount; Case/Package: SMD/SMT; Contact Plating: Silver; Contact Material: Silver; Color: Black; Min Operating Temperature: -20°C; Max Operating Temperature: 60°C; Max Voltage Rating (DC): 12V; Packaging: Tape and Reel; Termination: Gull Wing; Package Quantity: 1; Current Rating: 50mA; Voltage Rating (DC): 12V; Orientation: Straight; Length: 6mm; Depth: 9mm; Lead Free: Lead Free; REACH SVHC: No SVHC; ComponentLink1URL: https://datasheet.ciiva.com/29903/getdatasheetpartid-786341-29903846.pdf?src-supplier=Verical; ComponentLink1Description: https://datasheet.ciiva.com/29903/getdatasheetpartid-786341-29903846.pdf?src-supplier=Verical; ComponentLink2URL: https://datasheet.ciiva.com/29931/getdatasheetpartid-764615-29931183.pdf?src-supplier=Verical; ComponentLink2Description: https://datasheet.ciiva.com/29931/getdatasheetpartid-764615-29931183.pdf?src-supplier=Verical; ComponentLink3URL: https://datasheet.ciiva.com/14920/pts645-14920733.pdf?src-supplier=Digi-Key; ComponentLink3Description: https://datasheet.ciiva.com/14920/pts645-14920733.pdf?src-supplier=Digi-Key; ComponentLink4URL: https://datasheet.ciiva.com/14920/pts645-14920734.pdf?src-supplier=Digi-Key; ComponentLink4Description: https://datasheet.ciiva.com/14920/pts645-14920734.pdf?src-supplier=Digi-Key; ComponentLink5URL: https://datasheet.ciiva.com/14920/pts645-14920735.pdf?src-supplier=Digi-Key; ComponentLink5Description: https://datasheet.ciiva.com/14920/pts645-14920735.pdf?src-supplier=Digi-Key; Supplier Part Number 1: CKN9112CT-ND
TP1 TP2 = TestPointHole: Test Point With Hole
U1 = 74LVC2G17DW-7: Buffers & Line Drivers LVC 2 Gates LOGIC; Manufacturer: Diodes; Number of Bits per Element: 1; High Level Output Current: -32mA; Low Level Output Current: 32mA; Polarity: Non-Inverting; Operating Supply Current: 10uA; Quiescent Current: 40uA; Turn-On Delay Time: 13.1ns; Number of Channels: 2; Max Supply Voltage: 5.5V; Min Supply Voltage: 1.65V; Logic Function: Schmitt Trigger,Buffer,Inverting; Supplier 1: Digi-Key; Manufacturer Part Number: 74LVC2G17DW-7; RoHS: Yes; Category: Buffers, Drivers and Transceivers; Stock 1: 12109; Pricing 1: 1=0.42000, 10=0.31400, 25=0.28320, 100=0.19570, 250=0.16484, 500=0.13392, 1000=0.10302 (USD); Mount: Surface Mount; Case/Package: SOT-363; Number of Pins: 6; Weight: 0.000212oz; Min Operating Temperature: -40°C; Max Operating Temperature: 125°C; Number of Input Lines: 1; Number of Output Lines: 1; Number of Inputs: 2; Number of Outputs: 2; Packaging: Tape and Reel; Propagation Delay: 13.1ns; Package Quantity: 1; Number of Elements: 2; Radiation Hardening: No; REACH SVHC: No SVHC; ComponentLink1URL: http://www.mouser.com/ds/2/115/74LVC2G17-219457.pdf?src-supplier=Mouser; ComponentLink1Description: http://www.mouser.com/ds/2/115/74LVC2G17-219457.pdf?src-supplier=Mouser; ComponentLink2URL: http://components.arrow.com/part/dataview/0323_05864131?src-supplier=Arrow+Europe; ComponentLink2Description: http://components.arrow.com/part/dataview/0323_05864131?src-supplier=Arrow+Europe; ComponentLink3URL: http://components.arrow.com/part/dataview/51721233S9314827N2867?src-supplier=Arrow+Electronics; ComponentLink3Description: http://components.arrow.com/part/dataview/51721233S9314827N2867?src-supplier=Arrow+Electronics; ComponentLink4URL: https://www.verical.com/server-webapp/html/getDatasheet?partID=688709&src-supplier=Verical; ComponentLink4Description: https://www.verical.com/server-webapp/html/getDatasheet?partID=688709&src-supplier=Verical; ComponentLink5URL: https://www.diodes.com/assets/Datasheets/74LVC2G17.pdf?src-supplier=Digi-Key; ComponentLink5Description: https://www.diodes.com/assets/Datasheets/74LVC2G17.pdf?src-supplier=Digi-Key; ComponentLink6URL: http://www.diodes.com/datasheets/74LVC2G17.pdf?src-supplier=Avnet; ComponentLink6Description: http://www.diodes.com/datasheets/74LVC2G17.pdf?src-supplier=Avnet; Supplier Part Number 1: 74LVC2G17DW-7DICT-ND